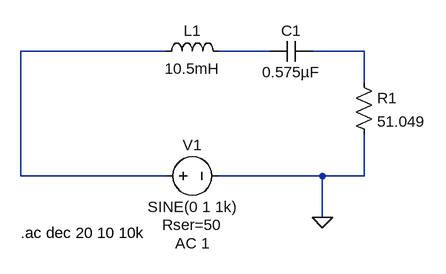
[diagram p0: schematic RLC_lab1.asc]
RLC_lab1.asc, the LTspice schematic file:
Version 4
SHEET 1 880 680
WIRE 336 0 112 0
WIRE 496 0 416 0
WIRE 640 0 560 0
WIRE 640 48 640 0
WIRE 112 192 112 0
WIRE 336 192 112 192
WIRE 576 192 416 192
WIRE 640 192 640 128
WIRE 640 192 576 192
WIRE 576 256 576 192
FLAG 576 256 0
SYMBOL res 624 32 R0
SYMATTR InstName R1
SYMATTR Value 51.049
SYMATTR SpiceLine tol=5 pwr=0.25
SYMBOL cap 496 16 R270
WINDOW 0 32 32 VTop 2
WINDOW 3 0 32 VBottom 2
SYMATTR InstName C1
SYMATTR Value 0.575µF
SYMBOL ind 320 16 R270
WINDOW 0 32 56 VTop 2
WINDOW 3 5 56 VBottom 2
SYMATTR InstName L1
SYMATTR Value 10.5mH
SYMBOL voltage 320 192 R270
WINDOW 0 32 56 VTop 2
WINDOW 3 -32 56 VBottom 2
WINDOW 123 -88 56 VBottom 2
WINDOW 39 -60 56 VBottom 2
SYMATTR InstName V1
SYMATTR Value SINE(0 1 1k)
SYMATTR Value2 AC 1
SYMATTR SpiceLine Rser=50
TEXT 112 280 Left 2 !.ac dec 20 10 10k

The netlist it stands for:
* RLC_lab1.asc
R1 N003 0 51.049 tol=5 pwr=0.25
C1 N002 N003 0.575µF
L1 N001 N002 10.5mH
V1 N001 0 SINE(0 1 1k) AC 1 Rser=50
.ac dec 20 10 10k
.backanno
.end